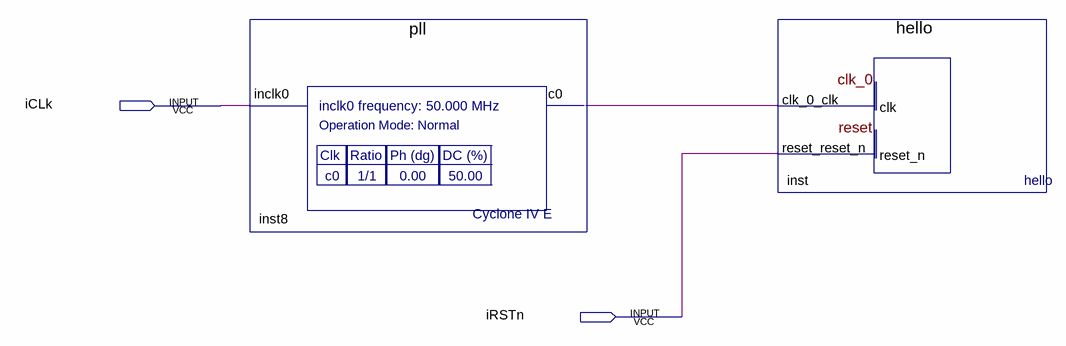
[diagram p0: schematic sheet]
// Quartus schematic Hello_Nios_II.bdf as structural Verilog: 2 symbols, 2 pins
module Hello_Nios_II (
  input  iCLk,
  input  iRSTn
);

  wire inst8_c0;

  pll inst8 (.inclk0(iCLk), .c0(inst8_c0));
  hello inst (.clk_0_clk(inst8_c0), .reset_reset_n(iRSTn));
endmodule
